# Altium schematic sheet PWM_PART.SchDoc
size A4
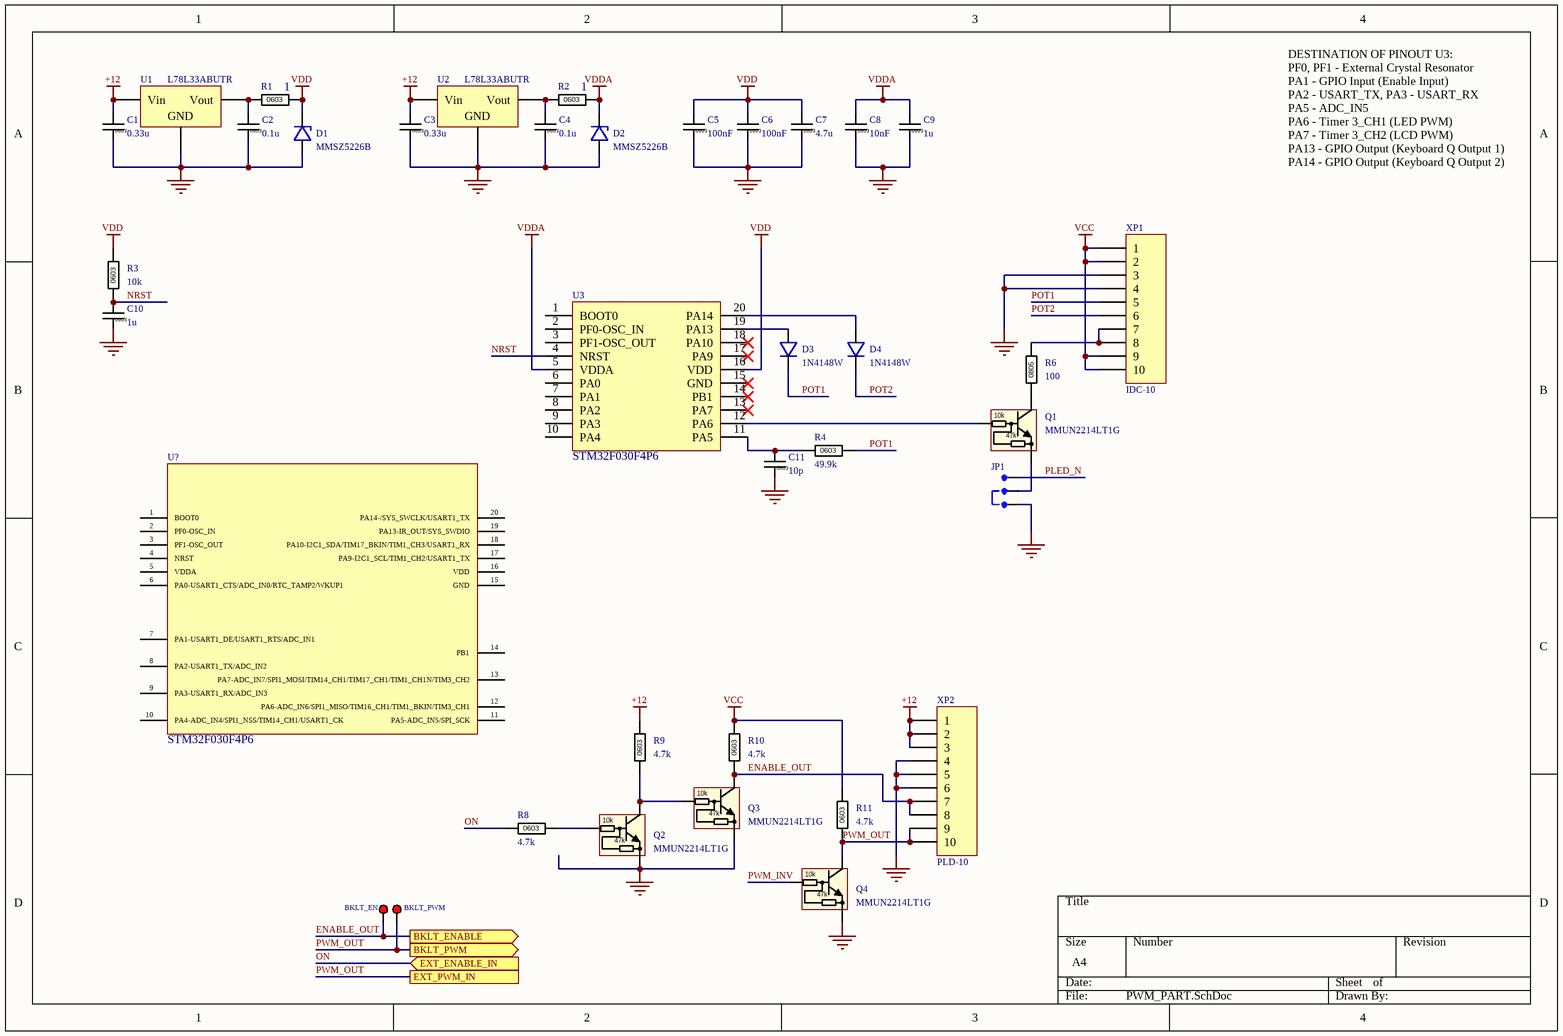
[diagram p0: PWM_PART.SchDoc]

## Parts
C1  Cap: 0.33u  Foot: 0603  [CAP_0603]  (hidden comment: 0603-X7R-50-0.33 мкф)
C2  Cap: 0.1u  Foot: 0603  [CAP_0603]  (hidden comment: 0603-X7R-50-0.1 мкф)
C3  Cap: 0.33u  Foot: 0603  [CAP_0603]  (hidden comment: 0603-X7R-50-0.33 мкф)
C4  Cap: 0.1u  Foot: 0603  [CAP_0603]  (hidden comment: 0603-X7R-50-0.1 мкф)
C5  Cap: 100nF  Foot: 0603  [CAP_0603]  (hidden comment: 0603-NP0-50-100 нф)
C6  Cap: 100nF  Foot: 0603  [CAP_0603]  (hidden comment: 0603-NP0-50-100 нф)
C7  Cap: 4.7u  Foot: 0603  [CAP_0603]  (hidden comment: 0603-X7R-25 4.7 мкф K)
C8  Cap: 10nF  Foot: 0603  [CAP_0603]  (hidden comment: 0603-NP0-50-10 нф)
C9  Cap: 1u  Foot: 0603  [CAP_0603]  (hidden comment: 0603-X7R-25 1 мкф)
C10  Cap: 1u  Foot: 0603  [CAP_0603]  (hidden comment: 0603-X7R-25 1 мкф)
C11  Cap: 10p  Foot: 0603  [CAP_0603]  (hidden comment: 0603-NP0-50-10 пф C)
D1  MMSZ5226B  [SOD_123]
D2  MMSZ5226B  [SOD_123]
D3  1N4148W  [SOD_123]
D4  1N4148W  [SOD_123]
JP1  (no value)  [CONN_JUMPER 3PIN 2.54MM]
Q1  MMUN2214LT1G  [SOT_23]
Q2  MMUN2214LT1G  [SOT_23]
Q3  MMUN2214LT1G  [SOT_23]
Q4  MMUN2214LT1G  [SOT_23]
R1  value 1  Foot: 0603  [RESistor_0603]  (hidden comment: 0603-1  J)
R2  value 1  Foot: 0603  [RESistor_0603]  (hidden comment: 0603-1  J)
R3  value 10k  Foot: 0603  [resistor_0603]  (hidden comment: 0603-10к F)
R4  value 49.9k  Foot: 0603  [resistor_0603]  (hidden comment: 0603-49.9к F)
R6  value 100  Foot: 0805  [resistor_0805]  (hidden comment: 0805-100 J)
R8  value 4.7k  Foot: 0603  [resistor_0603]  (hidden comment: 0603-4.7 к J)
R9  value 4.7k  Foot: 0603  [resistor_0603]  (hidden comment: 0603-4.7 к J)
R10  value 4.7k  Foot: 0603  [resistor_0603]  (hidden comment: 0603-4.7 к J)
R11  value 4.7k  Foot: 0603  [resistor_0603]  (hidden comment: 0603-4.7 к J)
TP7  BKLT_EN  [OTHER_SMD_TP_1.5MM]
TP8  BKLT_PWM  [OTHER_SMD_TP_1.5MM]
U1  L78L33ABUTR  [SOT_89]
U2  L78L33ABUTR  [SOT_89]
U3  STM32F030F4P6  [TSSOP_20]
U?  STM32F030F4P6  [TSSOP_20]
XP1  IDC-10  [CONN_IDC-10]
XP2  PLD-10  [CONN_PLD-10]

## Ports
BKLT_ENABLE (out), BKLT_PWM (out), EXT_ENABLE_IN (in), EXT_PWM_IN

## Nets
+12: C1.1 C3.1 R9.2 U1.3(Vin) U2.3(Vin) XP2.1 XP2.2 XP2.3
GND: C1.2 C2.2 C3.2 C4.2 C5.2 C6.2 C7.2 C8.2 C9.2 C10.2 C11.2 D1.A D2.A JP1.1 Q2.2(E) Q3.2(E) Q4.2(E) U1.2(GND) U2.2(GND) XP1.3 XP1.4 XP2.4 XP2.5 XP2.6
VCC: R10.2 R11.2 XP1.1 XP1.2 XP1.9 XP1.10
VDD: C5.1 C6.1 C7.1 D1.C R1.2 R3.2 U3.16(VDD)
VDDA: C8.1 C9.1 D2.C R2.2 U3.5(VDDA)
ENABLE_OUT: Q3.3(C) R10.1 TP7.1 XP2.7 XP2.8 ; port BKLT_ENABLE
NRST: C10.1 R3.1 U3.4(NRST)
ON: R8.1 ; port EXT_ENABLE_IN
PLED_N: JP1.3
POT1: D3.C R4.2 XP1.5
POT2: D4.C XP1.6
PWM_INV: Q4.1(B)
PWM_OUT: Q4.3(C) R11.1 TP8.1 XP2.9 XP2.10 ; port BKLT_PWM, port EXT_PWM_IN
NetC2_1: C2.1 R1.1 U1.1(Vout)
NetC4_1: C4.1 R2.1 U2.1(Vout)
NetC11_1: C11.1 R4.1 U3.11(PA5)
NetD3_A: D3.A U3.19(PA13)
NetD4_A: D4.A U3.20(PA14)
NetJP1_2: JP1.2 Q1.2(E)
NetQ1_1: Q1.1(B) U3.12(PA6)
NetQ1_3: Q1.3(C) R6.1
NetQ2_1: Q2.1(B) R8.2
NetQ2_3: Q2.3(C) Q3.1(B) R9.1
NetR6_2: R6.2 XP1.7 XP1.8

Not connected (* = marked no-connect by the designer): U3 1(BOOT0) 2(PF0-OSC_IN) 3(PF1-OSC_OUT) 6(PA0) 7(PA1) 8(PA2) 9(PA3) 10(PA4) 13(PA7)* 14(PB1)* 15(GND)* 17(PA9)* 18(PA10)*; U? 1(BOOT0) 2(PF0-OSC_IN) 3(PF1-OSC_OUT) 4(NRST) 5(VDDA) 6(PA0-USART1_CTS/ADC_IN0/RTC_TAMP2/WKUP1) 7(PA1-USART1_DE/USART1_RTS/ADC_IN1) 8(PA2-USART1_TX/ADC_IN2) 9(PA3-USART1_RX/ADC_IN3) 10(PA4-ADC_IN4/SPI1_NSS/TIM14_CH1/USART1_CK) 11(PA5-ADC_IN5/SPI_SCK) 12(PA6-ADC_IN6/SPI1_MISO/TIM16_CH1/TIM1_BKIN/TIM3_CH1) 13(PA7-ADC_IN7/SPI1_MOSI/TIM14_CH1/TIM17_CH1/TIM1_CH1N/TIM3_CH2) 14(PB1) 15(GND) 16(VDD) 17(PA9-I2C1_SCL/TIM1_CH2/USART1_TX) 18(PA10-I2C1_SDA/TIM17_BKIN/TIM1_CH3/USART1_RX) 19(PA13-IR_OUT/SYS_SWDIO) 20(PA14-/SYS_SWCLK/USART1_TX)

## Notes on the sheet
- DESTINATION OF PINOUT U3:
  PF0, PF1 - External Crystal Resonator
  PA1 - GPIO Input (Enable Input)
  PA2 - USART_TX, PA3 - USART_RX
  PA5 - ADC_IN5
  PA6 - Timer 3_CH1 (LED PWM)
  PA7 - Timer 3_CH2 (LCD PWM)
  PA13 - GPIO Output (Keyboard Q Output 1)
  PA14 - GPIO Output (Keyboard Q Output 2)
- (in symbol MMUN2214LT1G_50V 0.1A 0.25W) 10k; 47k

## Library data of the parts
C1 C3 = 0603-X7R-50-0.33 мкф: Конденсатор Чип Керамический; Voltage: 50V
C2 C4 = 0603-X7R-50-0.1 мкф: Конденсатор Чип Керамический; Voltage: 50V; Price, $: 0.1
C5 C6 C8 = 0603-NP0-50-100 пф: Конденсатор Чип Керамический; Voltage: 50V; Price, $: 0.1
C7 = 0603-X7R-25 4.7 мкф K: Конденсатор Чип Керамический; Voltage: 25V
C9 C10 = 0603-X7R-25 1 мкф: Конденсатор Чип Керамический; Voltage: 25V
C11 = 0603-NP0-50-10 пф C: Конденсатор Чип Керамический; Voltage: 50V; Tolerance: 0.5%
D1 D2 = ZENER_MMSZ5226B: Стабилитрон 3.3В 0.5Вт [SOD-123]
D3 D4 = IMPULSE DIODE_1N4148W: Диод 150мА 100В [SOD-123]
JP1 = CONN_JUMPER 2.54 MM
Q1-Q4 = MMUN2214LT1G_50V 0.1A 0.25W: NPN Digital Transistor; Published: 17-Sep-2003; DatasheetDocument: Jun-1999; PackageDocument: May-1999; PackageReference: SOT23; Publisher: Altium Limited
R1 R2 = 0603-1 J: Резистор Чип; Power: 0.1W; Price, $: 0.015
R3 = 0603-10 к F: Резистор Чип; Power: 0.1W; Tolerance: 1%
R4 = 0603-49.9к F: Резистор Чип; Power: 0.1W; Tolerance: 1%
R6 = 0805-100 J: Резистор Чип; Power: 0.125W
R8-R11 = 0603-4.7 к J: Резистор Чип; Power: 0.1W; Price, $: 0.015
TP7 TP8 = Test Point_1.5MM
U1 U2 = LDO_L78L33ABUTR: Cтабилизатор напряжения (+3.3В; 0.1А), [SOT-89] /; Published: 24-Mar-1999; LatestRevisionDate: 29-May-2009; LatestRevisionNote: IPC-7351 Footprint Added.; PackageReference: D2PAK; Publisher: Altium Limited; PackageDescription: 3-Pin Transistor Outline Package 2.54 mm Pitch, 15.1 mm Lead Span
U3 U? = MCU_STM32F030F4P6: Микроконтроллер 32-Бит, Cortex-M0, 48МГц, 16КБ Flash; MF: Microchip Technology; MP: ATMEGA8-16AU; Package: TQFP-32 Microchip Technology; Value: *; Price: None; SnapEDA_Link: https://www.snapeda.com/parts/ATMEGA8-16AU/Microchip/view-part/4246640/?ref=snap; Availability: Unavailable
XP1 = CONN_IDC-10 (Single Row): Header, 10-Pin; LatestRevisionDate: 17-Jul-2002; LatestRevisionNote: Re-released for DXP Platform.; Publisher: Altium Limited
XP2 = CONN_Header 10 (Single Row)_1: Header, 10-Pin; LatestRevisionDate: 17-Jul-2002; LatestRevisionNote: Re-released for DXP Platform.; Publisher: Altium Limited